# EAGLE design adapter (EAGLE 7.6.0)
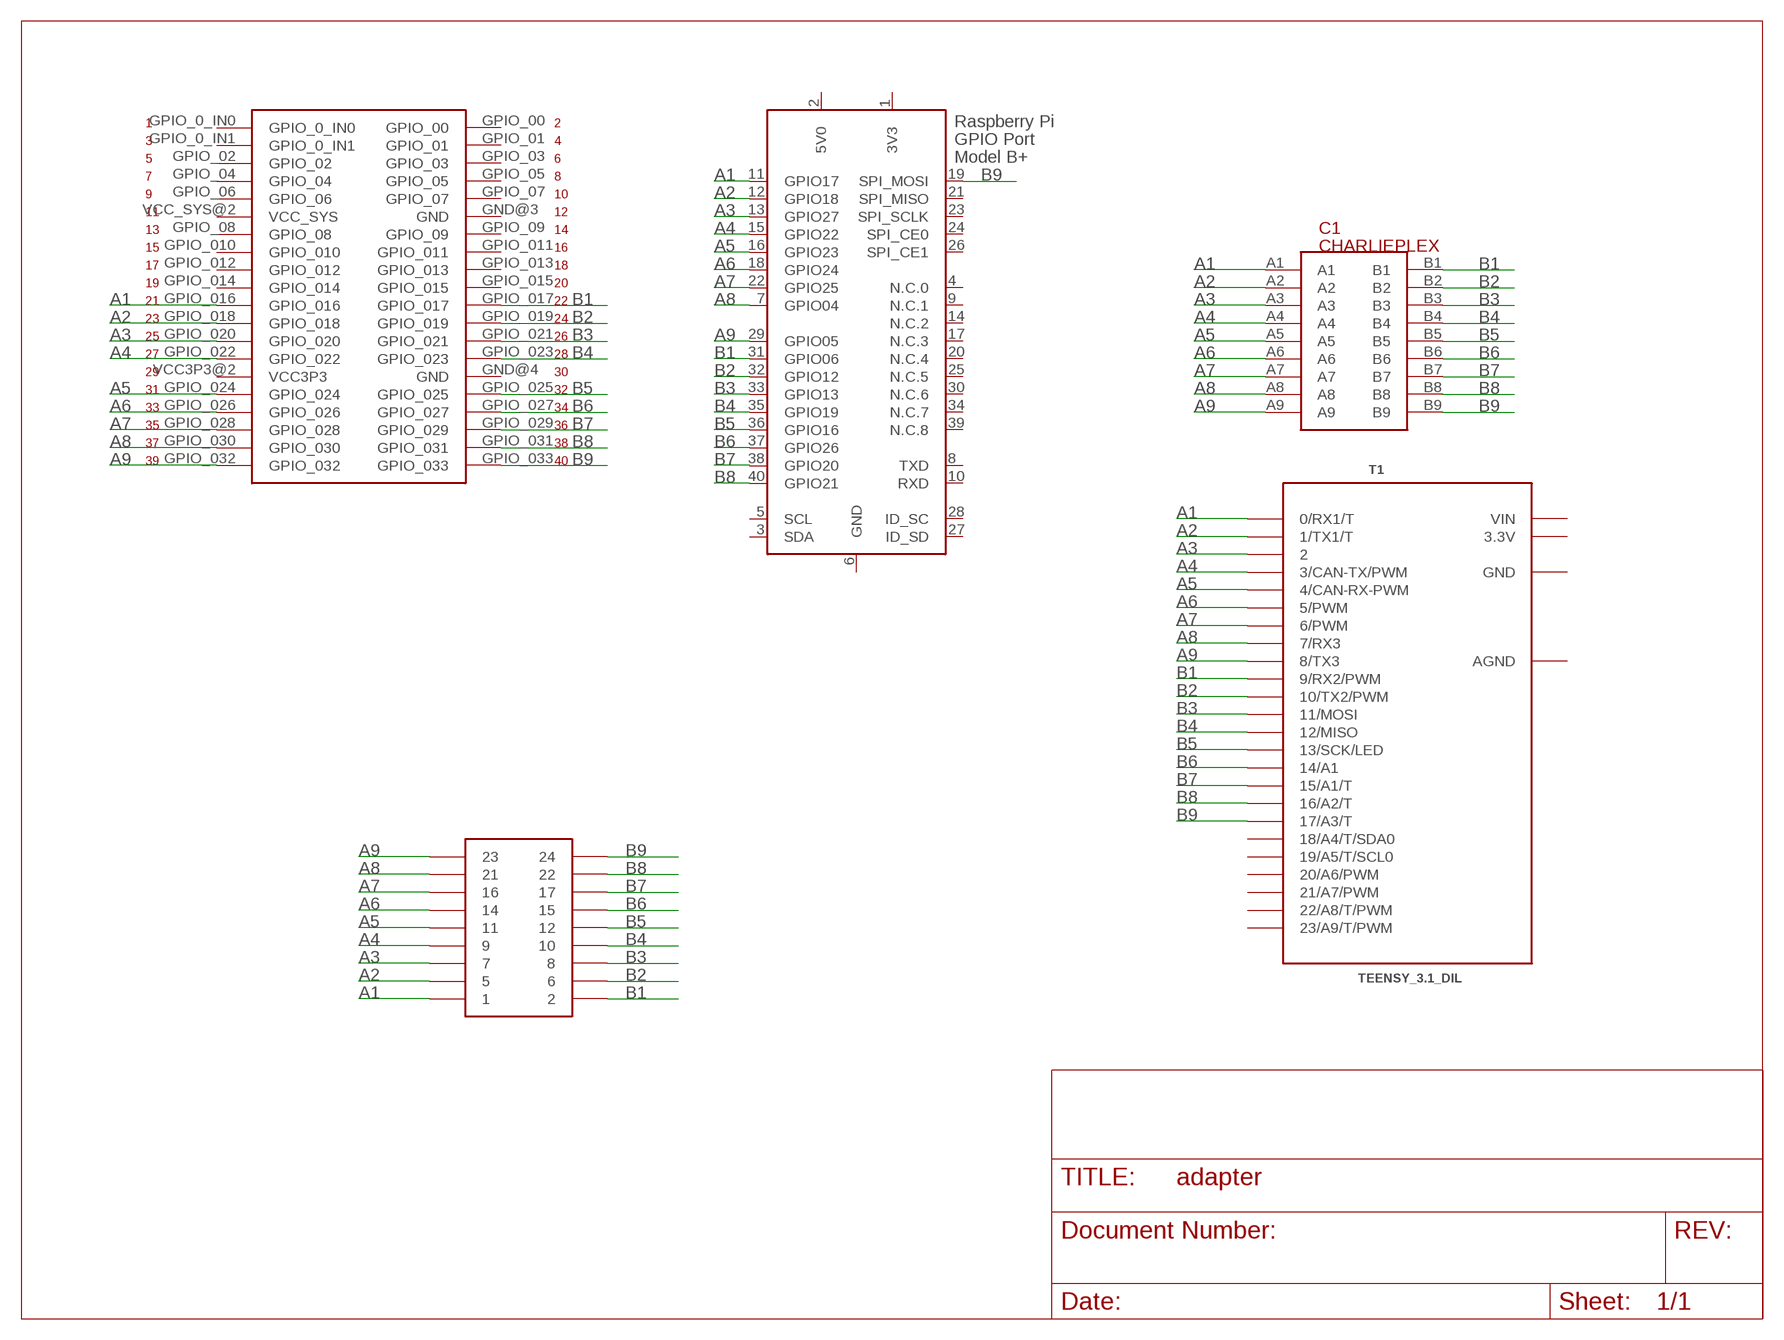
[diagram p0: schematic, sheet 1]

## Parts
C1  CHARLIEPLEX  [CHARLIEPLEXED]
T1  TEENSY_3.1_DIL  [TEENSY3-DIL]
U$1  MOJO_V2_HEADER1_CHOPPED  [MOJO_V2_HEADER1_CHOPPED]
U$2  DE0_NANO_JP1  [DE0_NANO_JP1]
X1  RASPI_GPIO_B+_PIN  [RASPI_GPIO_B+_PIN]

## Nets
A1: C1.A1 T1.0(0/RX1/T) U$1.1 U$2.GPIO_016 X1.11(GPIO17)
A2: C1.A2 T1.1(1/TX1/T) U$1.5 U$2.GPIO_018 X1.12(GPIO18)
A3: C1.A3 T1.2 U$1.7 U$2.GPIO_020 X1.13(GPIO27)
A4: C1.A4 T1.3(3/CAN-TX/PWM) U$1.9 U$2.GPIO_022 X1.15(GPIO22)
A5: C1.A5 T1.4(4/CAN-RX-PWM) U$1.11 U$2.GPIO_024 X1.16(GPIO23)
A6: C1.A6 T1.5(5/PWM) U$1.14 U$2.GPIO_026 X1.18(GPIO24)
A7: C1.A7 T1.6(6/PWM) U$1.16 U$2.GPIO_028 X1.22(GPIO25)
A8: C1.A8 T1.7(7/RX3) U$1.21 U$2.GPIO_030 X1.7(GPIO04)
A9: C1.A9 T1.8(8/TX3) U$1.23 U$2.GPIO_032 X1.29(GPIO05)
B1: C1.B1 T1.9(9/RX2/PWM) U$1.2 U$2.GPIO_017 X1.31(GPIO06)
B2: C1.B2 T1.10(10/TX2/PWM) U$1.6 U$2.GPIO_019 X1.32(GPIO12)
B3: C1.B3 T1.11(11/MOSI) U$1.8 U$2.GPIO_021 X1.33(GPIO13)
B4: C1.B4 T1.12(12/MISO) U$1.10 U$2.GPIO_023 X1.35(GPIO19)
B5: C1.B5 T1.13(13/SCK/LED) U$1.12 U$2.GPIO_025 X1.36(GPIO16)
B6: C1.B6 T1.14/A0(14/A1) U$1.15 U$2.GPIO_027 X1.37(GPIO26)
B7: C1.B7 T1.15/A1(15/A1/T) U$1.17 U$2.GPIO_029 X1.38(GPIO20)
B8: C1.B8 T1.16/A2(16/A2/T) U$1.22 U$2.GPIO_031 X1.40(GPIO21)
B9: C1.B9 T1.17/A3(17/A3/T) U$1.24 U$2.GPIO_033 X1.19(SPI_MOSI)
Unconnected: T1.18/A4(18/A4/T/SDA0) T1.19/A5(19/A5/T/SCL0) T1.20/A6(20/A6/PWM) T1.21/A7(21/A7/PWM) T1.22/A8(22/A8/T/PWM) T1.23/A9(23/A9/T/PWM) U$2.GPIO_00 U$2.GPIO_0_IN0 U$2.GPIO_0_IN1 U$2.GPIO_01 U$2.GPIO_02 U$2.GPIO_03 U$2.GPIO_04 U$2.GPIO_05 U$2.GPIO_06 U$2.GPIO_07 U$2.GPIO_08 U$2.GPIO_09 U$2.GPIO_010 U$2.GPIO_011 U$2.GPIO_012 U$2.GPIO_013 U$2.GPIO_014 U$2.GPIO_015 X1.3(SDA) X1.4(N.C.0) X1.5(SCL) X1.8(TXD) X1.9(N.C.1) X1.10(RXD) X1.14(N.C.2) X1.17(N.C.3) X1.20(N.C.4) X1.21(SPI_MISO) X1.23(SPI_SCLK) X1.24(SPI_CE0) X1.25(N.C.5) X1.26(SPI_CE1) X1.27(ID_SD) X1.28(ID_SC) X1.30(N.C.6) X1.34(N.C.7) X1.39(N.C.8)

## Power pins joined to a net without a drawn wire
3.3V: T1.3.3V
3V3: X1.1(3V3)
5V0: X1.2(5V0)
AGND: T1.AGND
GND: T1.GND U$2.GND@3(GND) U$2.GND@4(GND) X1.6(GND)
VCC3P3: U$2.VCC3P3@2(VCC3P3)
VCC_SYS: U$2.VCC_SYS@2(VCC_SYS)
VIN: T1.VIN

## Library data of the parts
C1 = adafruit_charlieplex_and_pushbutton:CHARLIEPLEX: Adafruit 9x16 16x9 led matrix charlieplexed
T1 = Teensy_3_and_LC_Series_Boards_v1.1:TEENSY_3.1_DIL: Teensy 3.1 or 3.2 in a DIL Layout.
U$1 = EmbeddedMicro-Mojo:MOJO_V2_HEADER1_CHOPPED: Only the header in mojo v2 header 1
U$2 = de0-nano:DE0_NANO_JP1: DE0-Nano JP1 only
X1 = raspberrypi_bastelstube_v13:RASPI_GPIO_B+: Only the 2x20 header connector, nothing else

## Board
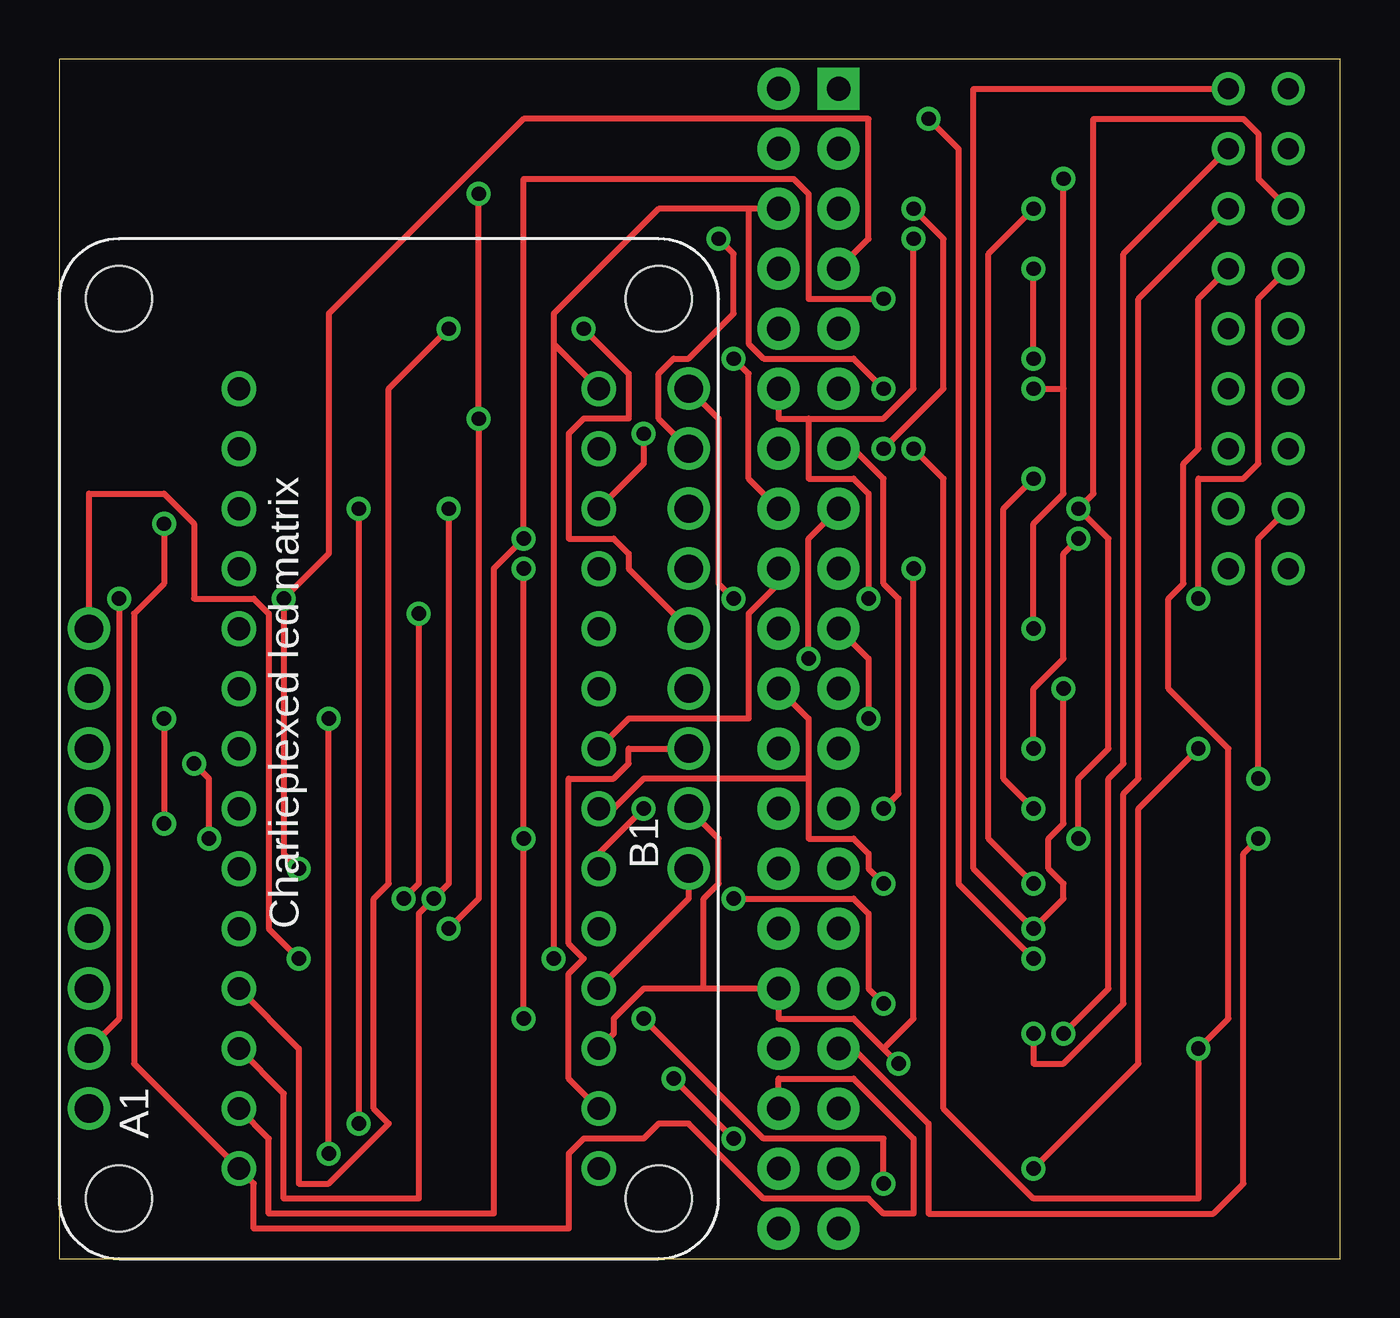
[diagram p1: board, top side]
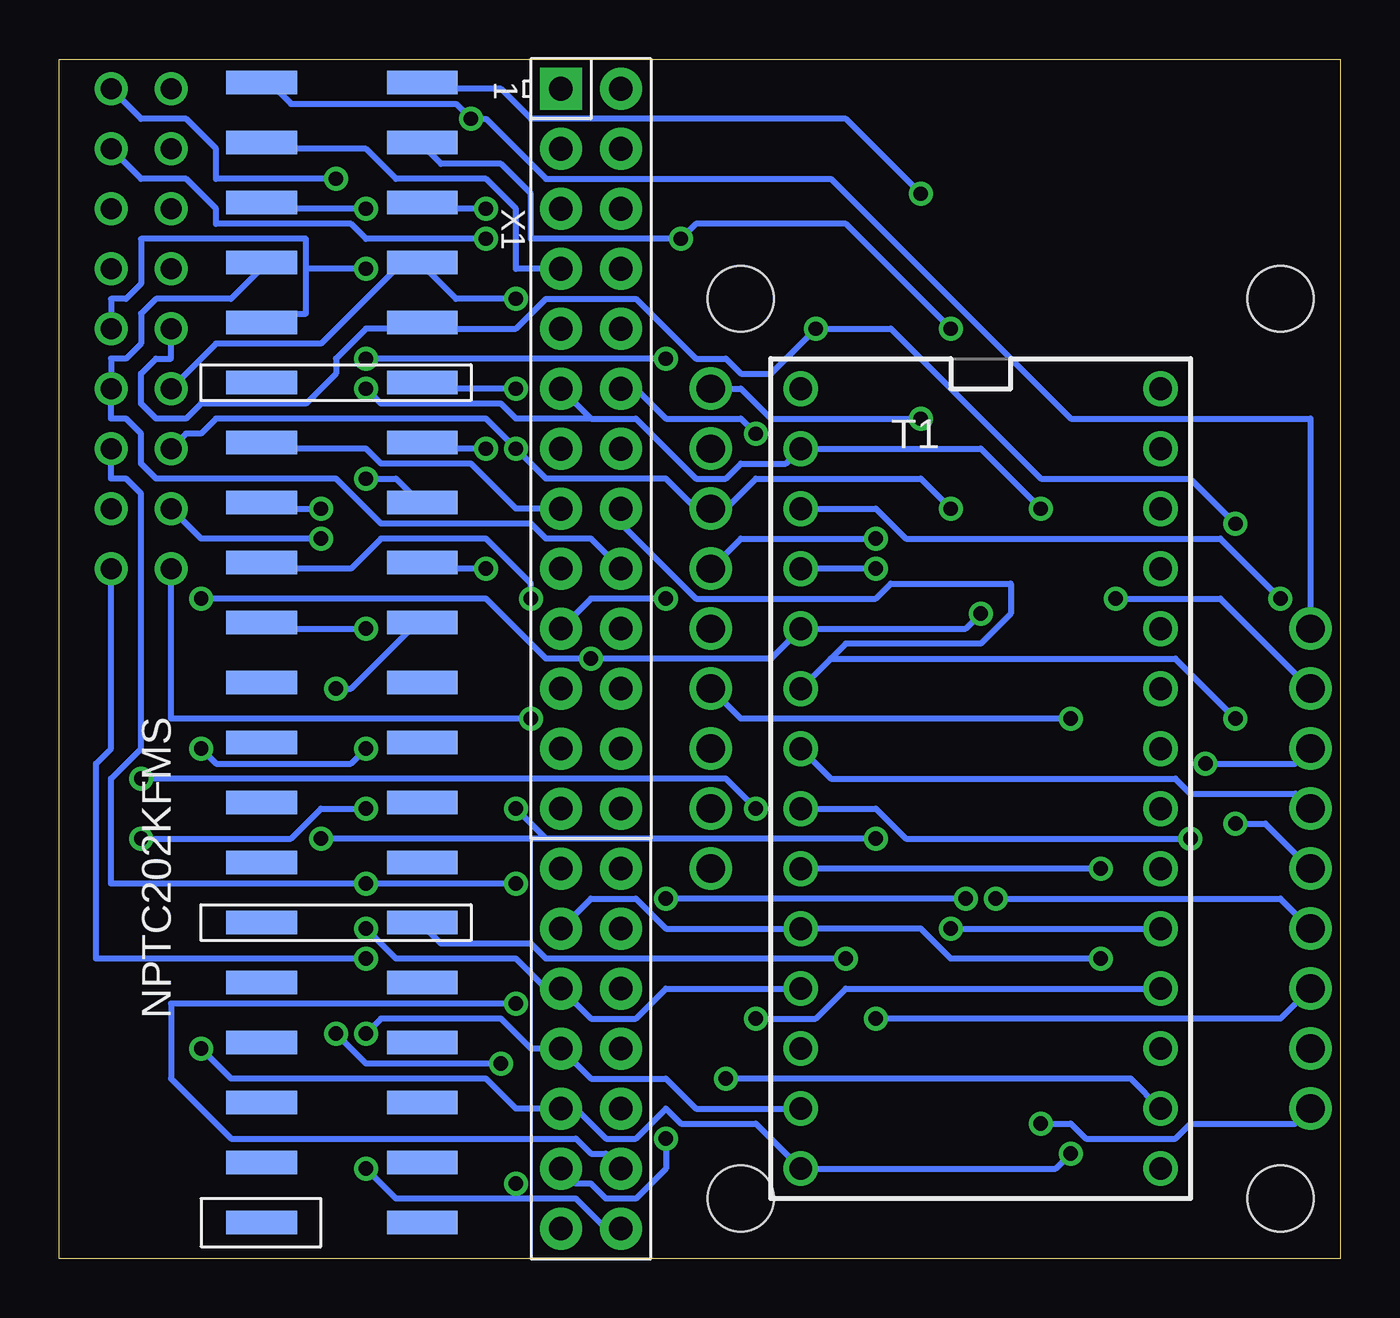
[diagram p2: board, bottom side, seen from below]

Size 54.28 x 50.79 mm. Coordinates in mm from the lower left corner, seen from the top.
Outline: 0,0 54.28,0 54.28,50.79 0,50.79 0,0
Copper layers (1*16): Top 0.035mm / dielectric 1.5mm / Bottom 0.035mm
Design rules "default": minimum track width 10mil, minimum drill 24mil, track to track 8mil, track to pad 8mil, pad to pad 8mil, via to via 8mil, smd to smd 8mil, copper to edge 40mil, drill to drill 8mil, minimum pad ring 10mil, minimum via ring 8mil, stop-mask expansion 4mil, vias tented up to drill 0mil, thermal gap 10mil

### Footprints (pad centres in the part's own frame; a part is rotated, then mirrored left to right if it is on the bottom)
CHARLIEPLEXED = drill 1.2: A1 -12.7,-15.24; A2 -12.7,-12.7; A3 -12.7,-10.16; A4 -12.7,-7.62; A5 -12.7,-5.08; A6 -12.7,-2.54; A7 -12.7,0; A8 -12.7,2.54; A9 -12.7,5.08; B1 12.7,-5.08; B2 12.7,-2.54; B3 12.7,0; B4 12.7,2.54; B5 12.7,5.08; B6 12.7,7.62; B7 12.7,10.16; B8 12.7,12.7; B9 12.7,15.24 | hole 2.8: -11.43,19.05; 11.43,19.05; -11.43,-19.05; 11.43,-19.05
TEENSY3-DIL = drill 0.965: 0 -7.62,13.97; 1 -7.62,11.43; 2 -7.62,8.89; 3 -7.62,6.35; 3.3V 7.62,11.43; 4 -7.62,3.81; 5 -7.62,1.27; 6 -7.62,-1.27; 7 -7.62,-3.81; 8 -7.62,-6.35; 9 -7.62,-8.89; 10 -7.62,-11.43; 11 -7.62,-13.97; 12 -7.62,-16.51; 13 7.62,-16.51; 14/A0 7.62,-13.97; 15/A1 7.62,-11.43; 16/A2 7.62,-8.89; 17/A3 7.62,-6.35; 18/A4 7.62,-3.81; 19/A5 7.62,-1.27; 20/A6 7.62,1.27; 21/A7 7.62,3.81; 22/A8 7.62,6.35; 23/A9 7.62,8.89; AGND 7.62,13.97; GND -7.62,16.51; VIN 7.62,16.51
MOJO_V2_HEADER1_CHOPPED = drill 0.9: 1 10.16,-1.27; 2 10.16,1.27; 5 7.62,-1.27; 6 7.62,1.27; 7 5.08,-1.27; 8 5.08,1.27; 9 2.54,-1.27; 10 2.54,1.27; 11 0,-1.27; 12 0,1.27; 14 -2.54,-1.27; 15 -2.54,1.27; 16 -5.08,-1.27; 17 -5.08,1.27; 21 -7.62,-1.27; 22 -7.62,1.27; 23 -10.16,-1.27; 24 -10.16,1.27
DE0_NANO_JP1 = smd 1 x 3: GND@3 11.69,-3.02; GND@4 -11.17,-3.02; GPIO_00 -23.87,-3.02; GPIO_0_IN0 -23.87,3.78; GPIO_0_IN1 -21.33,3.78; GPIO_01 -21.33,-3.02; GPIO_02 -18.79,3.78; GPIO_03 -18.79,-3.02; GPIO_04 -16.25,3.78; GPIO_05 -16.25,-3.02; GPIO_06 -13.71,3.78; GPIO_07 -13.71,-3.02; GPIO_08 -8.63,3.78; GPIO_09 -8.63,-3.02; GPIO_010 -6.09,3.78; GPIO_011 -6.09,-3.02; GPIO_012 -3.55,3.78; GPIO_013 -3.55,-3.02; GPIO_014 -1.01,3.78; GPIO_015 -1.01,-3.02; GPIO_016 1.53,3.78; GPIO_017 1.53,-3.02; GPIO_018 4.07,3.78; GPIO_019 4.07,-3.02; GPIO_020 6.61,3.78; GPIO_021 6.61,-3.02; GPIO_022 9.15,3.78; GPIO_023 9.15,-3.02; GPIO_024 14.23,3.78; GPIO_025 14.23,-3.02; GPIO_026 16.77,3.78; GPIO_027 16.77,-3.02; GPIO_028 19.31,3.78; GPIO_029 19.31,-3.02; GPIO_030 21.85,3.78; GPIO_031 21.85,-3.02; GPIO_032 24.39,3.78; GPIO_033 24.39,-3.02; VCC3P3@2 -11.17,3.78; VCC_SYS@2 11.69,3.78
RASPI_GPIO_B+_PIN = drill 1 pad 1.778 square: 1 -24.13,-1.27 | drill 1 pad 1.778: 2 -24.13,1.27; 3 -21.59,-1.27; 4 -21.59,1.27; 5 -19.05,-1.27; 6 -19.05,1.27; 7 -16.51,-1.27; 8 -16.51,1.27; 9 -13.97,-1.27; 10 -13.97,1.27; 11 -11.43,-1.27; 12 -11.43,1.27; 13 -8.89,-1.27; 14 -8.89,1.27; 15 -6.35,-1.27; 16 -6.35,1.27; 17 -3.81,-1.27; 18 -3.81,1.27; 19 -1.27,-1.27; 20 -1.27,1.27; 21 1.27,-1.27; 22 1.27,1.27; 23 3.81,-1.27; 24 3.81,1.27; 25 6.35,-1.27; 26 6.35,1.27; 27 8.89,-1.27; 28 8.89,1.27; 29 11.43,-1.27; 30 11.43,1.27; 31 13.97,-1.27; 32 13.97,1.27; 33 16.51,-1.27; 34 16.51,1.27; 35 19.05,-1.27; 36 19.05,1.27; 37 21.59,-1.27; 38 21.59,1.27; 39 24.13,-1.27; 40 24.13,1.27

### Placement (x,y rotation side)
C1  13.97,21.59 0 top
T1  15.24,20.32 0 bottom
U$1  50.8,39.37 90 top
U$2  41.91,25.4 90 bottom
X1  31.75,25.4 270 bottom

### Tracks (layer width: path | path; a pad name or v marks a point on that pad's centre or on a via)
A1  (via drill 0.61)
  Top 0.254: 42.55,36.83 42.55,32.38 41.27,31.11 v41.27,26.67 | 42.55,36.83 v42.55,45.72 | v12.7,31.75 v12.7,5.71 | v41.27,36.83 42.55,36.83
  Bottom 0.254: U$1.1 50.8,48.26 48.9,48.26 47.62,46.99 47.62,45.72 v42.55,45.72 | v41.27,26.67 45.09,26.67 U$2.GPIO_016 | 31.75,35.56 29.84,35.56 27.3,33.02 26.04,33.02 25.4,33.66 23.5,33.66 T1.0 15.24,34.29 v12.7,31.75 | X1.11 31.75,35.56 | C1.A1 1.91,5.71 6.35,5.71 6.99,5.08 10.79,5.08 11.43,5.71 v12.7,5.71 | v41.27,36.83 40.64,36.2 35.56,36.2 34.92,35.56 31.75,35.56
A2  (via drill 0.61)
  Top 0.254: v36.2,43.18 36.2,36.83 34.92,35.56 31.75,35.56 | 31.75,35.56 30.48,35.56 X1.12 | T1.1 24.77,33.66 v24.77,34.92 | v34.29,27.94 34.29,32.38 33.66,33.02 31.75,33.02 31.75,35.56 | C1.A2 2.54,10.16 v2.54,27.94
  Bottom 0.254: U$1.5 50.8,45.72 48.9,45.72 47.62,44.45 47.62,43.81 41.91,43.81 41.27,43.18 v36.2,43.18 | v24.77,34.92 25.4,35.56 28.57,35.56 29.84,36.83 X1.12 | v34.29,27.94 34.29,28.57 36.2,30.48 40.64,30.48 41.91,29.21 45.09,29.21 U$2.GPIO_018 | v2.54,27.94 5.08,30.48 18.41,30.48 19.68,31.75 T1.1
A3  (via drill 0.61)
  Top 0.254: U$1.7 50.8,45.72 50.8,47.62 50.16,48.26 43.81,48.26 43.81,32.38 v43.18,31.75 44.45,30.48 44.45,21.59 43.18,20.32 v43.18,17.78 | v19.68,10.16 v19.68,17.78 v19.68,29.21 | X1.13 33.66,34.29 34.92,33.02 34.92,28.57 35.56,27.94 35.56,19.68 v34.92,19.05
  Bottom 0.254: v43.18,31.75 45.09,31.75 U$2.GPIO_020 | v19.68,29.21 T1.2 | v19.68,10.16 2.54,10.16 C1.A3 | 33.66,17.78 v34.92,19.05 | v19.68,17.78 33.66,17.78 | 33.66,17.78 v43.18,17.78
A4  (via drill 0.61)
  Top 0.254: U$1.9 50.8,40.64 50.8,33.66 50.16,33.02 48.26,33.02 v48.26,27.94 | v14.61,15.24 15.24,15.88 v15.24,27.3 | X1.15 31.75,30.48 v31.75,25.4
  Bottom 0.254: X1.15 34.92,31.75 36.83,33.66 40.64,33.66 41.27,34.29 45.09,34.29 U$2.GPIO_022 | v48.26,27.94 36.2,27.94 33.66,25.4 v31.75,25.4 24.13,25.4 T1.3 15.88,26.67 v15.24,27.3 | C1.A4 2.54,15.24 v14.61,15.24
A5  (via drill 0.61)
  Top 0.254: v4.45,22.86 v4.45,18.41 | v41.27,38.1 v41.27,41.91 | v28.57,38.1 29.21,37.47 29.21,33.02 X1.16
  Bottom 0.254: U$1.11 52.07,40.64 51.44,40.64 50.8,41.27 50.8,43.18 43.81,43.18 43.81,41.91 | 43.81,41.91 43.81,40.01 45.09,40.01 U$2.GPIO_024 | 21.59,25.4 20.95,26.04 15.24,26.04 13.97,27.3 13.97,28.57 19.05,28.57 19.68,27.94 27.3,27.94 30.48,31.11 X1.16 | 21.59,25.4 T1.4 | C1.A5 3.17,18.41 v4.45,18.41 | v4.45,22.86 6.99,25.4 21.59,25.4 | v41.27,41.91 43.81,41.91 | v28.57,38.1 v41.27,38.1
A6
  Top 0.254: T1.5 24.13,22.86 29.21,22.86 29.21,27.3 30.48,28.57 X1.18
  Bottom 0.254: U$2.GPIO_026 45.72,41.91 46.99,40.64 50.16,40.64 50.8,40.01 50.8,38.73 51.44,38.1 52.07,38.1 U$1.14 52.07,35.56 51.44,35.56 50.8,34.92 50.8,33.66 50.16,33.02 42.55,33.02 40.64,31.11 34.29,31.11 33.66,30.48 31.75,30.48 X1.18 | C1.A6 1.91,19.68 6.35,19.68 6.99,20.32 21.59,20.32 T1.5
A7  (via drill 0.61)
  Top 0.254: v34.92,15.88 34.29,16.51 34.29,17.14 33.66,17.78 31.75,17.78 31.75,20.32 | 31.75,20.32 31.75,22.86 X1.22 | T1.6 23.5,19.05 24.77,20.32 31.75,20.32 | v41.27,44.45 39.37,42.55 39.37,17.78 v41.27,15.88 | v5.71,20.95 6.35,20.32 v6.35,17.78
  Bottom 0.254: U$1.16 52.07,33.02 51.44,33.02 50.8,32.38 50.8,21.59 52.07,20.32 52.07,15.88 v41.27,15.88 v34.92,15.88 | v41.27,44.45 45.09,44.45 U$2.GPIO_028 | C1.A7 1.91,20.95 v5.71,20.95 | v6.35,17.78 18.41,17.78 19.68,19.05 T1.6
A8  (via drill 0.61)
  Top 0.254: U$1.21 50.8,30.48 v50.8,20.32 | v24.77,19.05 22.86,17.14 T1.7 | X1.7 34.29,43.18 34.29,48.26 19.68,48.26 11.43,40.01 11.43,29.84 v9.53,27.94 9.53,17.14 v10.16,16.51
  Bottom 0.254: v50.8,20.32 26.04,20.32 v24.77,19.05 | X1.7 34.92,41.91 34.92,44.45 36.2,45.72 40.01,45.72 41.27,46.99 45.09,46.99 U$2.GPIO_030 | C1.A8 5.08,27.94 v9.53,27.94 | v10.16,16.51 T1.7
A9  (via drill 0.61)
  Top 0.254: v41.27,12.7 38.1,15.88 38.1,46.99 v36.83,48.26 | v10.16,12.7 8.89,13.97 8.89,27.3 8.26,27.94 5.71,27.94 5.71,31.11 4.45,32.38 1.27,32.38 C1.A9
  Bottom 0.254: X1.29 31.75,15.24 29.84,15.24 28.57,13.97 T1.8 17.78,13.97 16.51,12.7 v10.16,12.7 | U$1.23 52.07,21.59 52.7,20.95 52.7,12.7 v41.27,12.7 | U$2.GPIO_032 45.09,49.53 44.45,48.9 37.47,48.9 v36.83,48.26 36.2,48.26 33.66,45.72 21.59,45.72 11.43,35.56 1.27,35.56 C1.A9
B1  (via drill 0.61)
  Top 0.254: T1.9 26.67,15.24 C1.B1 | U$1.2 38.73,49.53 38.73,16.51 v41.27,13.97 42.55,15.24 42.55,15.88 41.91,16.51 41.91,17.78 42.55,18.41 v42.55,24.13
  Bottom 0.254: v41.27,13.97 40.01,12.7 34.92,12.7 33.66,11.43 X1.31 31.75,10.16 29.84,10.16 28.57,11.43 T1.9 | v42.55,24.13 41.91,24.13 39.37,26.67 U$2.GPIO_017
B2  (via drill 0.61)
  Top 0.254: U$1.6 45.09,42.55 45.09,20.95 44.45,20.32 44.45,11.43 v42.55,9.53 | 34.92,8.89 33.66,10.16 30.48,10.16 X1.32 27.3,11.43 | 34.92,8.89 v35.56,8.26 | T1.10 23.5,9.53 23.5,10.16 24.77,11.43 27.3,11.43 | v36.2,29.21 36.2,10.16 34.92,8.89 | C1.B2 27.94,17.78 27.94,15.88 27.3,15.24 27.3,11.43
  Bottom 0.254: v42.55,9.53 41.27,8.26 v35.56,8.26 | v36.2,29.21 38.73,29.21 U$2.GPIO_019
B3  (via drill 0.61)
  Top 0.254: U$1.8 45.72,40.64 45.72,20.32 45.09,19.68 45.09,10.79 42.55,8.26 41.27,8.26 v41.27,9.53 | v41.27,33.02 40.01,31.75 40.01,20.32 v41.27,19.05 | v50.8,17.78 50.16,17.14 50.16,3.17 48.9,1.91 36.83,1.91 36.83,5.71 33.66,8.89 X1.33 | C1.B3 24.13,21.59 24.13,20.95 23.5,20.32 21.59,20.32 21.59,13.34 22.23,12.7 21.59,12.06 21.59,7.62 T1.11
  Bottom 0.254: v41.27,9.53 40.64,10.16 35.56,10.16 34.29,8.89 X1.33 31.75,7.62 28.57,7.62 27.3,6.35 T1.11 | v41.27,33.02 40.01,33.02 39.37,32.38 U$2.GPIO_021 | v41.27,19.05 43.18,19.05 44.45,17.78 v50.8,17.78
B4  (via drill 0.61)
  Top 0.254: U$1.10 48.26,40.64 48.26,34.29 47.62,33.66 47.62,28.57 46.99,27.94 46.99,24.13 49.53,21.59 49.53,10.16 v48.26,8.89 48.26,2.54 41.27,2.54 37.47,6.35 37.47,33.02 v36.2,34.29 | v11.43,4.45 v11.43,22.86
  Bottom 0.254: v48.26,8.89 46.99,7.62 36.2,7.62 34.92,6.35 X1.35 32.38,6.35 31.11,5.08 29.84,5.08 28.57,6.35 27.94,5.71 24.77,5.71 T1.12 12.06,3.81 v11.43,4.45 | v36.2,34.29 38.73,34.29 U$2.GPIO_023 | C1.B4 25.4,22.86 v11.43,22.86
B5  (via drill 0.61)
  Top 0.254: X1.36 30.48,7.62 33.66,7.62 36.2,5.08 36.2,1.91 34.92,1.91 34.29,2.54 29.84,2.54 26.67,5.71 25.4,5.71 24.77,5.08 22.23,5.08 21.59,4.45 21.59,1.27 8.26,1.27 8.26,3.17 T1.13 3.17,8.26 3.17,27.3 4.45,28.57 v4.45,31.11 | C1.B5 24.13,29.21 24.13,29.84 23.5,30.48 21.59,30.48 21.59,34.92 22.23,35.56 24.13,35.56 24.13,37.47 v22.23,39.37
  Bottom 0.254: U$1.12 49.53,38.1 50.16,38.1 50.8,37.47 50.8,36.2 50.16,35.56 48.9,35.56 48.26,36.2 43.81,36.2 42.55,37.47 42.55,38.1 41.27,39.37 39.37,39.37 U$2.GPIO_025 38.73,39.37 34.92,39.37 33.66,40.64 29.84,40.64 27.3,38.1 26.04,38.1 25.4,37.47 24.13,37.47 v22.23,39.37 19.05,39.37 12.7,33.02 6.35,33.02 v4.45,31.11
B6  (via drill 0.61)
  Top 0.254: T1.14/A0 8.89,5.08 8.89,1.91 18.41,1.91 18.41,29.21 v19.68,30.48 19.68,45.72 31.11,45.72 31.75,45.09 31.75,40.64 v34.92,40.64 | v26.04,7.62 v28.57,5.08
  Bottom 0.254: U$1.15 47.62,38.73 43.18,38.73 40.01,41.91 39.37,41.91 U$2.GPIO_027 38.73,41.91 37.47,40.64 v34.92,40.64 | v19.68,30.48 25.4,30.48 C1.B6 | X1.37 32.38,3.17 31.75,3.17 31.11,2.54 29.84,2.54 28.57,3.81 v28.57,5.08 | v26.04,7.62 8.89,7.62 T1.14/A0
B7  (via drill 0.61)
  Top 0.254: T1.15/A1 9.53,6.99 9.53,2.54 15.24,2.54 15.24,14.61 v15.88,15.24 16.51,15.88 v16.51,31.75 | v36.2,44.45 37.47,43.18 37.47,36.83 v34.92,34.29 | v34.92,10.79 34.29,11.43 34.29,14.61 33.66,15.24 v28.57,15.24
  Bottom 0.254: U$1.17 48.9,34.92 48.26,34.92 47.62,35.56 36.2,35.56 v34.92,34.29 33.66,33.02 28.57,33.02 27.3,31.75 C1.B7 26.04,31.75 24.77,33.02 17.78,33.02 v16.51,31.75 | v36.2,44.45 38.73,44.45 U$2.GPIO_029 | X1.38 31.11,4.45 31.75,4.45 32.38,5.08 46.99,5.08 49.53,7.62 49.53,10.79 v34.92,10.79 | v15.88,15.24 v28.57,15.24
B8  (via drill 0.61)
  Top 0.254: v27.94,43.18 28.57,42.55 28.57,40.01 26.67,38.1 26.04,38.1 25.4,37.47 25.4,35.56 C1.B8 | v43.18,30.48 42.55,29.84 42.55,25.4 41.27,24.13 v41.27,21.59 | v48.26,21.59 45.72,19.05 45.72,8.26 v41.27,3.81 | v24.77,10.16 29.84,5.08 34.92,5.08 v34.92,3.17 | v16.51,39.37 13.97,36.83 13.97,15.88 13.34,15.24 13.34,6.35 13.97,5.71 11.43,3.17 10.16,3.17 10.16,8.89 T1.16/A2
  Bottom 0.254: U$2.GPIO_031 38.73,46.99 38.1,46.35 35.56,46.35 34.29,45.09 34.29,43.18 v27.94,43.18 27.3,43.81 20.95,43.81 v16.51,39.37 | U$1.22 48.26,30.48 v43.18,30.48 | v41.27,21.59 41.91,20.95 47.62,20.95 v48.26,21.59 | v41.27,3.81 40.01,2.54 34.92,2.54 | 34.92,2.54 32.38,2.54 31.11,1.27 X1.40 | T1.16/A2 20.95,11.43 22.23,10.16 v24.77,10.16 | 34.92,2.54 v34.92,3.17
B9  (via drill 0.61)
  Top 0.254: v34.29,22.86 34.29,25.4 X1.19 | v16.51,13.97 17.78,15.24 v17.78,35.56 v17.78,45.09 | v28.57,27.94 27.94,28.57 27.94,35.56 C1.B9
  Bottom 0.254: U$1.24 49.53,22.86 v34.29,22.86 | v16.51,13.97 T1.17/A3 | v17.78,35.56 24.13,35.56 25.4,36.83 C1.B9 | v17.78,45.09 20.95,48.26 34.29,48.26 35.56,49.53 38.73,49.53 U$2.GPIO_033 | X1.19 31.75,27.94 v28.57,27.94
GND  (via drill 0.61)
  Top 0.254: 20.95,38.73 T1.GND | 20.95,38.73 20.95,40.01 25.4,44.45 29.21,44.45 | X1.6 29.21,44.45 | 20.95,38.73 v20.95,12.7 | v34.92,36.83 33.66,38.1 29.84,38.1 29.21,38.73 29.21,44.45
  Bottom 0.254: v20.95,12.7 33.66,12.7 34.29,13.34 38.1,13.34 38.73,13.97 U$2.GND@4 | v34.92,36.83 38.73,36.83 U$2.GND@3